# EAGLE design PCM2904_A2D (EAGLE 5.10)
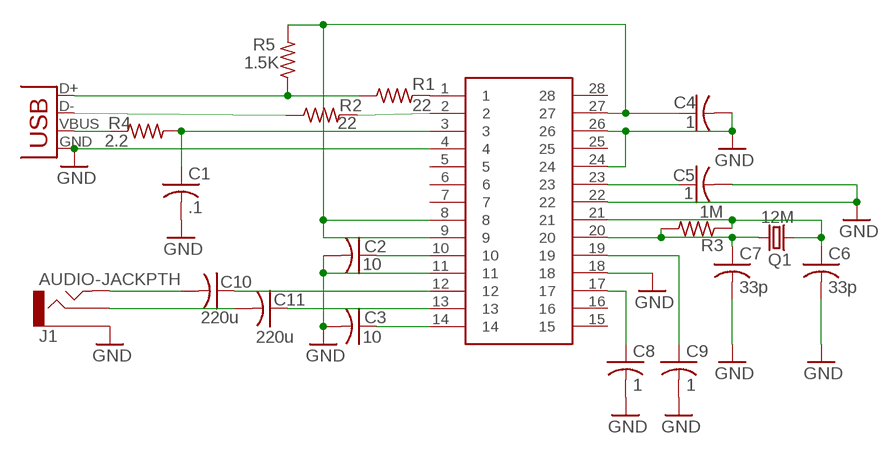
[diagram p0: schematic, sheet 1]

## Parts
C1  .1  C-USC0805  [C0805]
C2  10  C-USC1210  [C1210]
C3  10  C-USC1210  [C1210]
C4  1  C-USC1210  [C1210]
C5  1  C-USC1210  [C1210]
C6  33p  C-USC0805  [C0805]
C7  33p  C-USC0805  [C0805]
C8  1  C-USC1210  [C1210]
C9  1  C-USC1210  [C1210]
C10  220u  C-USC1210  [C1210]
C11  220u  C-USC1210  [C1210]
J1  AUDIO-JACKPTH  [AUDIO-JACK]
PCM2904  SSOP28  [SSOP28DB]
Q1  12M  CRYSTALHC49US  [HC49US]
R1  22  R-US_R0805  [R0805]
R2  22  R-US_R0805  [R0805]
R3  1M  R-US_R0805  [R0805]
R4  2.2  R-US_R0805  [R0805]
R5  1.5K  R-US_R0805  [R0805]
X2  USBSMD  [USB-MINIB]

## Nets
GND: C1.2 C2.2 C3.2 C4.2 C5.2 C6.2 C7.2 C8.2 C9.2 J1.1 PCM2904.4 PCM2904.11 PCM2904.18 PCM2904.22 PCM2904.24 PCM2904.26 X2.GND
N$1: PCM2904.1 R1.2
N$2: PCM2904.2 R2.2
N$3: C6.1 PCM2904.21 Q1.2 R3.1
N$4: R1.1 R5.1 X2.D+
N$5: R2.1 X2.D-
N$6: R4.1 X2.VBUS
N$7: C1.1 PCM2904.3 R4.2
N$8: C4.1 PCM2904.8 PCM2904.9 PCM2904.27 R5.2
N$9: C5.1 PCM2904.23
N$10: C2.1 PCM2904.10
N$11: C3.1 PCM2904.14
N$12: C10.2 J1.5
N$13: C10.1 PCM2904.12
N$14: C8.1 PCM2904.17
N$15: C11.2 J1.2
N$16: C9.1 PCM2904.19
N$19: C7.1 PCM2904.20 Q1.1 R3.2
N$24: C11.1 PCM2904.13
Unconnected: PCM2904.5 PCM2904.6 PCM2904.7 PCM2904.15 PCM2904.16 PCM2904.25 PCM2904.28

## Library data of the parts
C1-C11 = resistor:C-US: CAPACITOR, American symbol
J1 = SparkFun:AUDIO-JACK: 3.5mm Audio Jack Simple 3.5mm common PCB mount audio jack. SKU: PRT-08032
PCM2904 = SparkFun:SSOP28
Q1 = SparkFun:CRYSTAL: Crystals Various standard crystals. Proven footprints. Spark Fun Electronics SKU : COM-00534
R1-R5 = resistor:R-US_: RESISTOR, American symbol
X2 = SparkFun:USB: USB Connectors USB-B-PTH is fully proven SKU : PRT-00139 USB-miniB is fully proven SKU : PRT-00587 USB-A-PCB is untested. USB-A-H is throughly reviewed, but untested. Spark Fun Electronics SKU : PRT-00437 USB-B-SMT is throughly reviewed, but untested. Needs silkscreen touching up. USB-A-S has not been used/tested USB-MB-H has not been used/tested

## Board
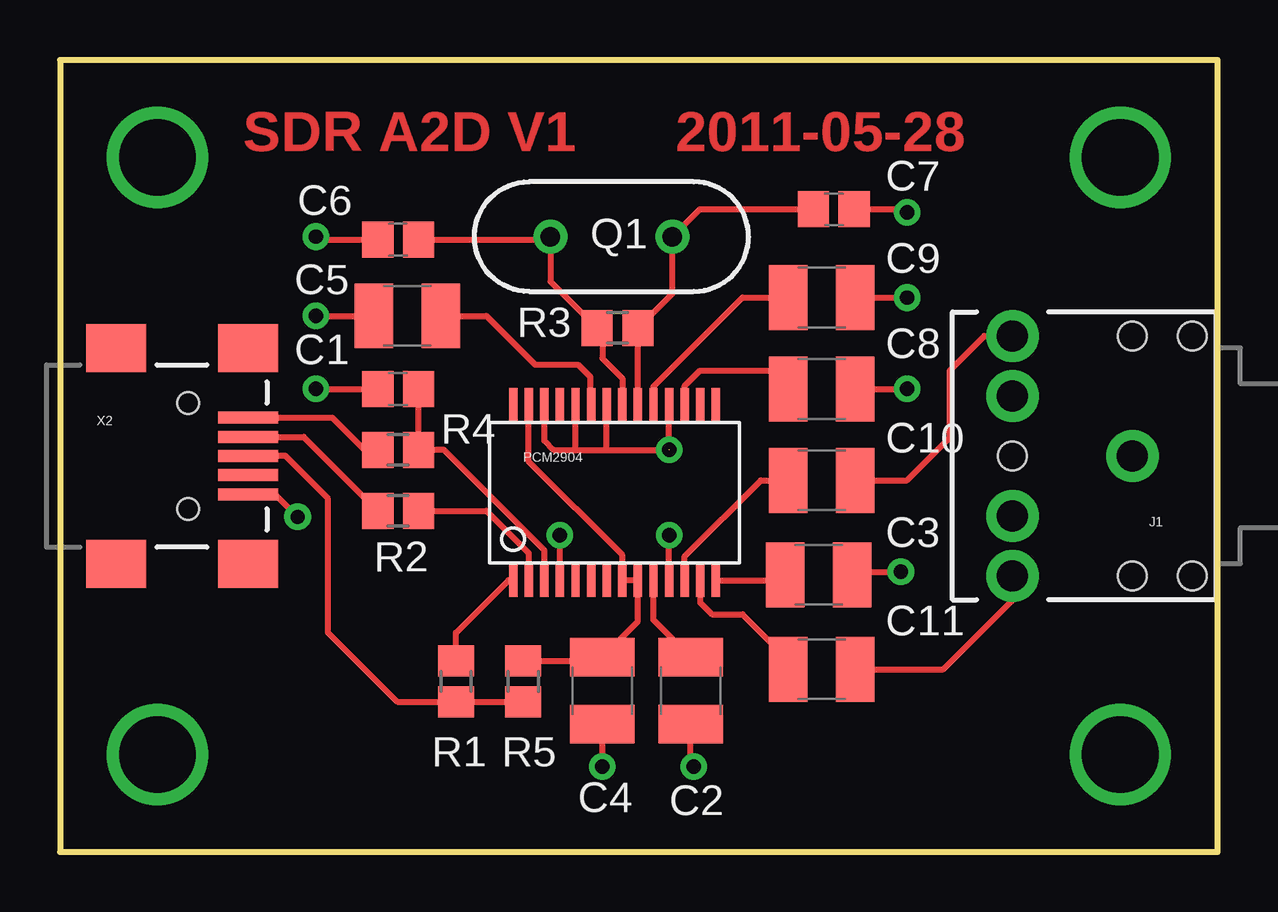
[diagram p1: board, top side]
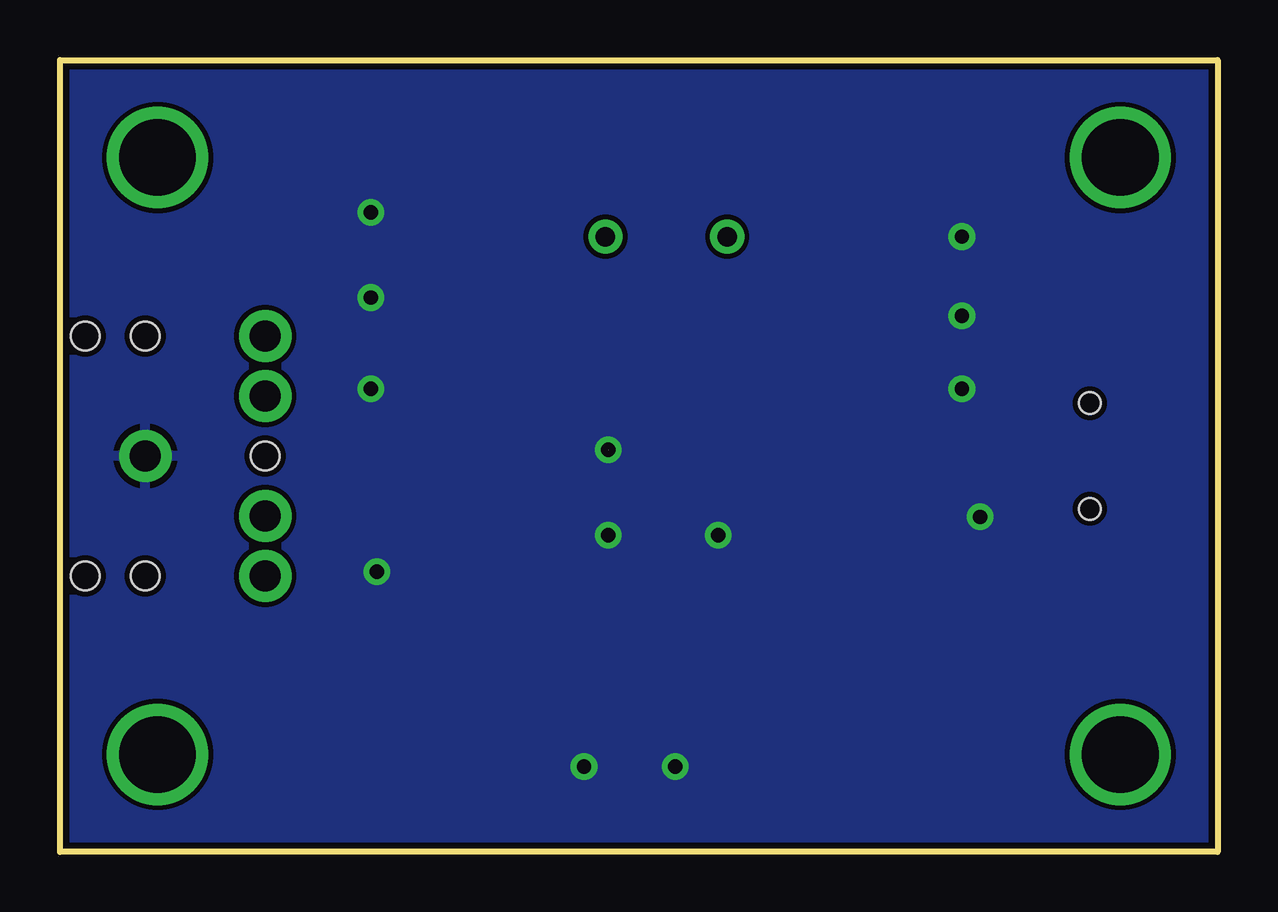
[diagram p2: board, bottom side, seen from below]

Size 48.26 x 33.02 mm. Coordinates in mm from the lower left corner, seen from the top.
Outline: 0,0 48.26,0 48.26,33.02 0,33.02 0,0
Copper layers (1*16): Top 0.035mm / dielectric 1.5mm / Bottom 0.035mm
Design rules "SparkFun": minimum track width 8mil, minimum drill 20mil, track to track 8mil, track to pad 8mil, pad to pad 8mil, via to via 8mil, smd to smd 8mil, copper to edge 10mil, drill to drill 8mil, minimum pad ring 12mil, minimum via ring 10mil, stop-mask expansion 4mil, vias tented up to drill 25mil, thermal gap 10mil

### Footprints (pad centres in the part's own frame; a part is rotated, then mirrored left to right if it is on the bottom)
C0805 = smd 1.3 x 1.5: 1 -0.85,0; 2 0.85,0
C1210 = smd 1.6 x 2.7: 1 -1.4,0; 2 1.4,0
AUDIO-JACK = drill 1.3 pad 2.184 round: 1 0,0; 2 5,5; 3 5,2.5; 4 5,-2.5; 5 5,-5 | hole 1.2: 0,5; -2.5,5; -2.5,-5; 0,-5; 5,0
SSOP28DB = smd 0.348 x 1.397: 1 -4.225,-3.656; 2 -3.575,-3.656; 3 -2.925,-3.656; 4 -2.275,-3.656; 5 -1.625,-3.656; 6 -0.975,-3.656; 7 -0.325,-3.656; 8 0.325,-3.656; 9 0.975,-3.656; 10 1.625,-3.656; 11 2.275,-3.656; 12 2.925,-3.656; 13 3.575,-3.656; 14 4.225,-3.656; 15 4.225,3.656; 16 3.575,3.656; 17 2.925,3.656; 18 2.275,3.656; 19 1.625,3.656; 20 0.975,3.656; 21 0.325,3.656; 22 -0.325,3.656; 23 -0.975,3.656; 24 -1.625,3.656; 25 -2.275,3.656; 26 -2.925,3.656; 27 -3.575,3.656; 28 -4.225,3.656
HC49US = drill 0.813 round: 1 -2.54,0; 2 2.54,0
R0805 = smd 1.3 x 1.5: 1 -0.85,0; 2 0.85,0
USB-MINIB = smd 2.5 x 0.5: D+ 2.5,0; D- 2.5,0.8; GND 2.5,-1.6; ID 2.5,-0.8; VBUS 2.5,1.6 | smd 2.5 x 2: GND@1 -3,-4.5; GND@2 -3,4.5; GND@3 2.5,4.5; GND@4 2.5,-4.5 | hole 0.9: 0,2.2; 0,-2.2

### Placement (x,y rotation side)
C1  14.1,19.3 180 top
C2  26.29,6.73 270 top
C3  31.62,11.56 0 top
C4  22.61,6.73 270 top
C5  14.48,22.35 180 top
C6  14.1,25.53 180 top
C7  32.26,26.8 0 top
C8  31.75,19.3 0 top
C9  31.75,23.11 0 top
C10  31.75,15.49 0 top
C11  31.75,7.62 0 top
J1  44.7,16.51 180 top
PCM2904  23.11,14.99 0 top
Q1  22.99,25.65 180 top
R1  16.51,7.11 90 top
R2  14.1,14.22 0 top
R3  23.24,21.84 0 top
R4  14.1,16.76 0 top
R5  19.3,7.11 90 top
X2  5.33,16.51 0 top

### Tracks (layer width: path | path; a pad name or v marks a point on that pad's centre or on a via)
GND  (via drill 0.6)  (1 unrouted)
  Top 0.254: PCM2904.26 20.19,17.15 20.57,16.76 21.49,16.76 | 22.79,16.76 25.39,16.76 PCM2904.18 | 21.49,16.76 PCM2904.24 | 22.79,16.76 PCM2904.22 | 21.49,16.76 22.79,16.76 | PCM2904.4 v20.84,13.21 v20.83,13.21 | PCM2904.11 25.39,13.21 v25.4,13.21 | v10.67,19.3 C1.2 | v10.67,22.35 C5.2 | v22.61,3.56 C4.2 | v35.05,11.68 33.15,11.68 C3.2 | C8.2 v35.31,19.3 | C6.2 10.79,25.53 v10.67,25.65 | C7.2 35.18,26.8 v35.31,26.67 | X2.GND 8.97,14.91 v9.91,13.97 | C9.2 v35.31,23.11 | C2.2 26.29,3.68 v26.42,3.56
  other vias: 25.4,16.76
  pour Bottom: 0,33.02 48.01,33.02 48.01,0 0,0
N$1
  Top 0.254: PCM2904.1 18.7,11.33 16.51,9.14 R1.2
N$2
  Top 0.254: R2.2 17.78,14.22 19.54,12.46 PCM2904.2
N$3
  Top 0.254: C6.1 20.32,25.53 Q1.2 20.45,23.79 R3.1 22.61,21.63 22.61,20.57 23.44,19.74 PCM2904.21
N$4
  Top 0.254: X2.D+ 9.4,16.51 11.18,14.73 11.18,9.14 14.06,6.26 R1.1 R5.1
N$5
  Top 0.254: X2.D- 10.16,17.31 R2.1
N$6
  Top 0.254: X2.VBUS 11.35,18.11 12.7,16.76 R4.1
N$7
  Top 0.254: PCM2904.3 20.19,12.58 16,16.76 R4.2 C1.1
N$8
  Top 0.254: PCM2904.27 19.54,16.27 23.44,12.38 PCM2904.8 PCM2904.9 24.09,9.61 C4.1 22.44,7.96 R5.2
N$9
  Top 0.254: PCM2904.23 22.1,18.68 22.1,19.81 21.59,20.32 19.81,20.32 17.78,22.35 C5.1
N$10
  Top 0.254: PCM2904.10 24.74,9.68 C2.1
N$11
  Top 0.254: PCM2904.14 30,11.33 C3.1
N$12
  Top 0.254: J1.5 38.53,21.51 37.08,20.07 37.08,17.27 35.31,15.49 C10.2
N$13
  Top 0.254: PCM2904.12 26.04,12.32 29.21,15.49 C10.1
N$14
  Top 0.254: PCM2904.17 26.04,19.43 26.67,20.07 29.59,20.07 C8.1
N$15
  Top 0.254: J1.2 39.7,10.49 36.83,7.62 C11.2
N$16
  Top 0.254: PCM2904.19 24.74,19.41 28.45,23.11 C9.1
N$17  (via drill 3.2)
  other vias: 4.06,28.96
N$18  (via drill 3.2)
  other vias: 4.06,4.06
N$19
  Top 0.254: C7.1 26.67,26.8 Q1.1 25.53,23.28 R3.2 PCM2904.20
N$20  (via drill 3.2)
  other vias: 44.2,28.96
N$23  (via drill 3.2)
  other vias: 44.2,4.06
N$24
  Top 0.254: PCM2904.13 26.69,10.39 27.18,9.91 28.45,9.91 30.35,8 C11.1

### Text on the board
Top: SDR A2D V1 | 2011-05-28